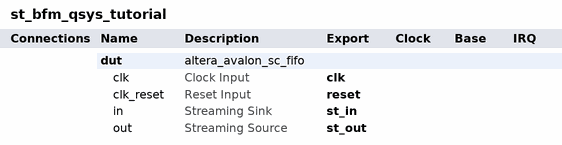
[diagram p0: system contents]
# Platform Designer (Qsys) system st_bfm_qsys_tutorial, Cyclone V Unknown
# Parameters at their usual value, and those the tool derives, are not listed.
package require -exact qsys 13.1
create_system st_bfm_qsys_tutorial
set_project_property DEVICE_FAMILY {Cyclone V}
set_project_property DEVICE Unknown

add_instance dut altera_avalon_sc_fifo 13.1
set_instance_parameter_value dut SYMBOLS_PER_BEAT 4
set_instance_parameter_value dut BITS_PER_SYMBOL 8
set_instance_parameter_value dut FIFO_DEPTH 2
set_instance_parameter_value dut CHANNEL_WIDTH 3
set_instance_parameter_value dut ERROR_WIDTH 3
set_instance_parameter_value dut USE_PACKETS 1
set_instance_parameter_value dut USE_FILL_LEVEL 0
set_instance_parameter_value dut USE_MEMORY_BLOCKS 1
set_instance_parameter_value dut USE_STORE_FORWARD 0

# exported interfaces
add_interface clk clock sink
set_interface_property clk EXPORT_OF dut.clk
add_interface reset reset sink
set_interface_property reset EXPORT_OF dut.clk_reset
add_interface st_in avalon_streaming sink
set_interface_property st_in EXPORT_OF dut.in
add_interface st_out avalon_streaming source
set_interface_property st_out EXPORT_OF dut.out

set_interconnect_requirement {$system} qsys_mm.clockCrossingAdapter HANDSHAKE
set_interconnect_requirement {$system} qsys_mm.maxAdditionalLatency 1

save_system st_bfm_qsys_tutorial.qsys
